# Altium schematic sheet 14-100M_Ethernet.SchDoc
size B; SheetNumber: 14; SheetTotal: 16
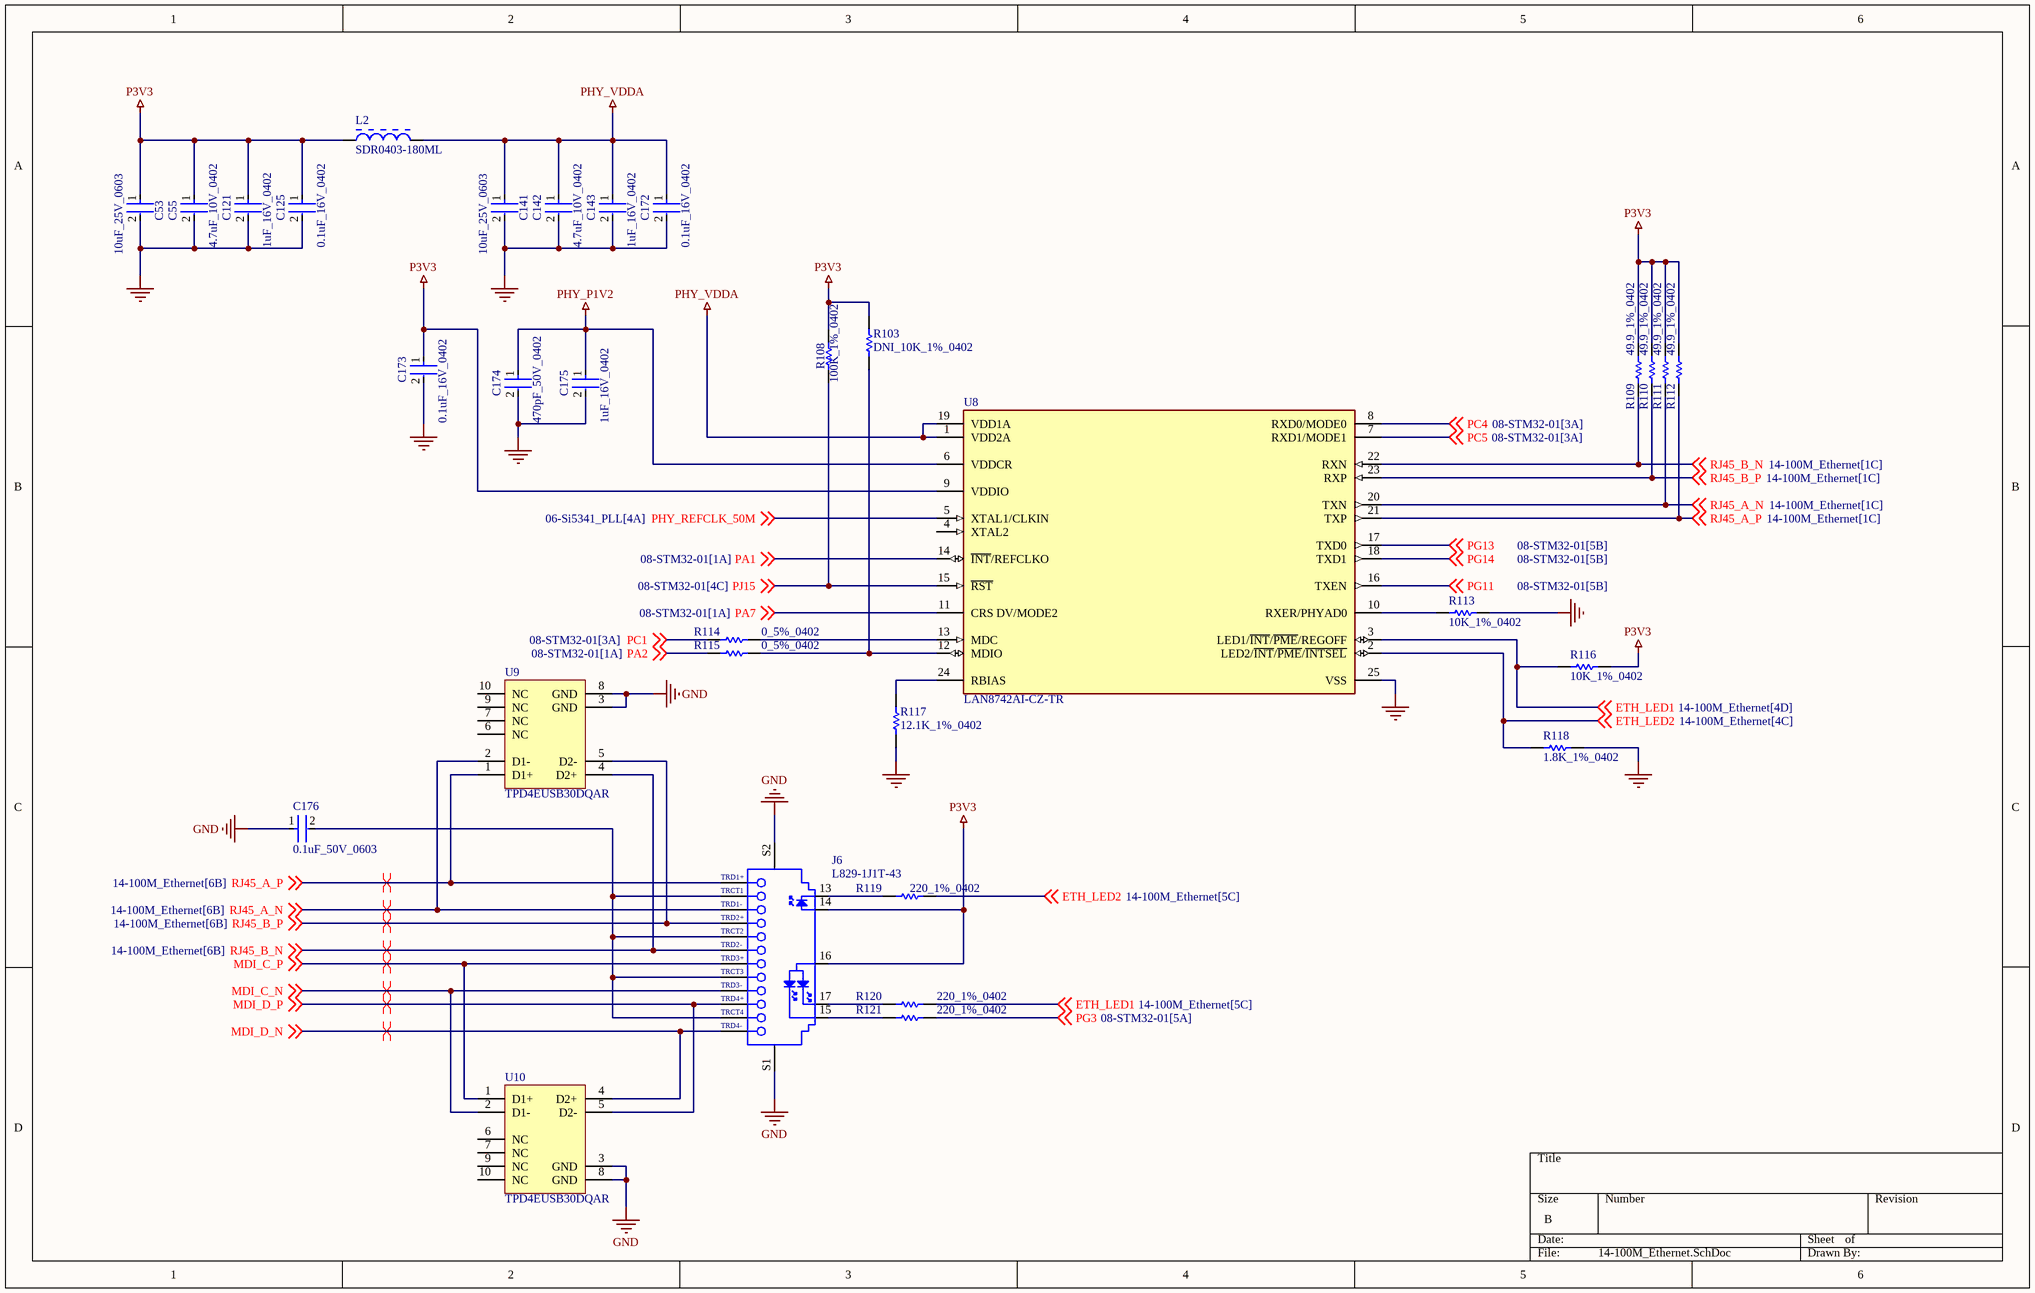
[diagram p0: 14-100M_Ethernet.SchDoc]

## Parts
C53  10uF_25V_0603  [FP-CL10-IPC_C]
C55  4.7uF_10V_0402  [FP-C1005-050-0_15-MFG]
C121  1uF_16V_0402  [FP-0402-L_1_0_0_05-W_0_5-IPC_A]
C125  0.1uF_16V_0402  [FP-C0402-BB-MFG]
C141  10uF_25V_0603  [FP-CL10-IPC_C]
C142  4.7uF_10V_0402  [FP-C1005-050-0_15-MFG]
C143  1uF_16V_0402  [FP-0402-L_1_0_0_05-W_0_5-IPC_A]
C172  0.1uF_16V_0402  [FP-C0402-BB-MFG]
C173  0.1uF_16V_0402  [FP-C0402-BB-MFG]
C174  470pF_50V_0402  [FP-GRM155-0_05-IPC_A]
C175  1uF_16V_0402  [FP-0402-L_1_0_0_05-W_0_5-IPC_A]
C176  0.1uF_50V_0603  [FP-C0603-CJ-MFG]
J6  L829-1J1T-43  [BELS-L829-1J1T-43_V]
L2  SDR0403-180ML  [BOUR-SDR0403-2_V]
R103  DNI_10K_1%_0402  [RESC1005X40X25NL10T10]  (no BOM)
R108  100K_1%_0402  [RESC1005X40X25ML05T10]
R109  49.9_1%_0402  [RESC1005X40X25NL10T10]
R110  49.9_1%_0402  [RESC1005X40X25NL10T10]
R111  49.9_1%_0402  [RESC1005X40X25NL10T10]
R112  49.9_1%_0402  [RESC1005X40X25NL10T10]
R113  10K_1%_0402  [RESC1005X40X25NL10T10]
R114  0_5%_0402  [RESC1005X40X25NL05T10]
R115  0_5%_0402  [RESC1005X40X25NL05T10]
R116  10K_1%_0402  [RESC1005X40X25NL10T10]
R117  12.1K_1%_0402  [RESC1005X40X25ML05T10]
R118  1.8K_1%_0402  [RESC1005X40X25LL05T05]
R119  220_1%_0402  [RESC1005X40X25LL10T10]
R120  220_1%_0402  [RESC1005X40X25LL10T10]
R121  220_1%_0402  [RESC1005X40X25LL10T10]
U8  LAN8742AI-CZ-TR  [FP-C04-143-MFG]
U9  TPD4EUSB30DQAR  [DQA0010A_V]
U10  TPD4EUSB30DQAR  [DQA0010A_V]

## Nets
GND: C53.2 C55.2 C121.2 C125.2 C141.2 C142.2 C143.2 C172.2 C173.2 C174.2 C175.2 C176.1 J6.S1 J6.S2 R113.1 R117.1 R118.2 U8.25(VSS) U9.3(GND) U9.8(GND) U10.3(GND) U10.8(GND)
P3V3: C53.1 C55.1 C121.1 C125.1 C173.1 J6.14 J6.16 L2.1 R103.1 R108.2 R109.1 R110.1 R111.1 R112.1 R116.1 U8.9(VDDIO)
PHY_P1V2: C174.1 C175.1 U8.6(VDDCR)
PHY_VDDA: C141.1 C142.1 C143.1 C172.1 L2.2 U8.1(VDD2A) U8.19(VDD1A)
ETH_LED1: R116.2 R120.2 U8.3(LED1/~{INT}/~{PME}/REGOFF) ; off-sheet ETH_LED1
ETH_LED2: R118.1 R119.2 U8.2(LED2/~{INT}/~{PME}/~{INTSEL}) ; off-sheet ETH_LED2
MDI_C_N: J6.9(TRD3-) U10.2(D1-) ; off-sheet MDI_C_N
MDI_C_P: J6.7(TRD3+) U10.1(D1+) ; off-sheet MDI_C_P
MDI_D_N: J6.12(TRD4-) U10.4(D2+) ; off-sheet MDI_D_N
MDI_D_P: J6.10(TRD4+) U10.5(D2-) ; off-sheet MDI_D_P
PA1: U8.14(~{INT}/REFCLKO) ; off-sheet PA1
PA2: R115.1 ; off-sheet PA2
PA7: U8.11(CRS_DV/MODE2) ; off-sheet PA7
PC1: R114.1 ; off-sheet PC1
PC4: U8.8(RXD0/MODE0) ; off-sheet PC4
PC5: U8.7(RXD1/MODE1) ; off-sheet PC5
PG3: R121.2 ; off-sheet PG3
PG11: U8.16(TXEN) ; off-sheet PG11
PG13: U8.17(TXD0) ; off-sheet PG13
PG14: U8.18(TXD1) ; off-sheet PG14
PHY_REFCLK_50M: U8.5(XTAL1/CLKIN) ; off-sheet PHY_REFCLK_50M
PJ15: R108.1 U8.15(~{RST}) ; off-sheet PJ15
RJ45_A_N: J6.3(TRD1-) R111.2 U8.20(TXN) U9.2(D1-) ; off-sheet RJ45_A_N
RJ45_A_P: J6.1(TRD1+) R112.2 U8.21(TXP) U9.1(D1+) ; off-sheet RJ45_A_P
RJ45_B_N: J6.6(TRD2-) R109.2 U8.22(RXN) U9.4(D2+) ; off-sheet RJ45_B_N
RJ45_B_P: J6.4(TRD2+) R110.2 U8.23(RXP) U9.5(D2-) ; off-sheet RJ45_B_P
NetC176_2: C176.2 J6.2(TRCT1) J6.5(TRCT2) J6.8(TRCT3) J6.11(TRCT4)
NetJ6_13: J6.13 R119.1
NetJ6_15: J6.15 R121.1
NetJ6_17: J6.17 R120.1
NetR103_2: R103.2 R115.2 U8.12(MDIO)
NetR113_2: R113.2 U8.10(RXER/PHYAD0)
NetR114_2: R114.2 U8.13(MDC)
NetR117_2: R117.2 U8.24(RBIAS)

Not connected (* = marked no-connect by the designer): U8 4(XTAL2); U9 6(NC) 7(NC) 9(NC) 10(NC); U10 6(NC) 7(NC) 9(NC) 10(NC)

## Layout directives
differential pair: MDI_C_N, MDI_C_P, MDI_D_N, MDI_D_P, RJ45_A_N, RJ45_A_P, RJ45_B_N, RJ45_B_P

## Library data of the parts
C53 C141 = CMP-13271-004224-1: Cap Ceramic 10uF 25V X5R ±20% Pad SMD 0603 +85°C T/R; Width: 0.031inch; Voltage Rating: 25V; Length: 0.063inch; Case Code (Metric): 1608; Dielectric: X5R; Termination: Wraparound; Capacitance: 10uF; Lead Free: Lead Free; Mount: Surface Mount; Package Quantity: 1; Case Code (Imperial): 0603; Thickness: 0.035inch; Packaging: Tape and Reel; Contact Plating: Tin; Min Operating Temperature: -55°C; Tolerance: 20%; Max Operating Temperature: 85°C; Case/Package: 0603
C55 C142 = CMP-2000-05997-2: CAP CER 4.7UF 10V X5R 0402; Dielectric Material: Ceramic; Tolerance: 10%; Series: C; Package Quantity: 10000; Max Operating Temperature: 85°C; Case Code (Imperial): 0402; Lead Free: Lead Free; Voltage Rating (DC): 10V; Packaging: Cut Tape; Voltage Rating: 10V; Min Operating Temperature: -55°C; Dielectric: X5R; Thickness: 0.022inch; Width: 0.02inch; Case/Package: 0402; Case Code (Metric): 1005; Capacitance: 4.7uF; Length: 0.039inch; RoHS Compliant: Yes; REACH SVHC: No SVHC; Mount: Surface Mount
C121 C143 C175 = CMP-14477-000104-2: None; Tolerance: 10%; Voltage Rating: 16V; Dielectric: X5R; Capacitance: 1uF; Packaging: Tape and Reel; Depth: 0.5mm; Mount: Surface Mount; Thickness: 0.022inch; Package Quantity: 1; Min Operating Temperature: -55°C; Series: M; Voltage Rating (DC): 16V; Termination: SMD/SMT; Case/Package: 0402; Number of Pins: 2; Case Code (Imperial): 0402; Length: 1mm; Halogen Free: Halogen Free; Case Code (Metric): 1005; Width: 0.02inch; RoHS Compliant: Yes; Radiation Hardening: No; Max Operating Temperature: 85°C; Height: 0.5mm; Construction: Flat
C125 C172 C173 = CMP-1034-02068-3: CAP CER 0.1UF 16V 5% X7R 0402; Manufacturer: Kemet; Manufacturer Part Number: C0402C104J4RACTU; Value: 0.10 μF; Temperature Coefficient: 15%; Tolerance: 0.05; Material: Ceramic; ComponentLink2URL: https://content.kemet.com/datasheets/KEM_C1002_X7R_SMD.pdf; Automotive: No; Device Class L2: Capacitors; Temperature: -55°C to +125°C; RoHS: TRUE; Voltage Rating: 16 V; ComponentLink2Description: Datasheet; Device Class L3: Ceramic Capacitors; Temperature Range Low: -55°C; Ipc Land Pattern Name: CAPC10050X50; Device Class L1: Passive Components; Temperature Range High: +125°C; Package: C0402-BB; Capacitance: 0.10 μF; Category: Cap; Mouser Description: CAP CER 0.1UF 16V X7R 0402; Height: 0.55mm; Digikey Description: CAP CER 0.1UF 16V 5% X7R 0402; Octopart: https://octopart.com/c0402c104j4ractu-kemet-12573893; Temperature Characteristic: X7R; Lead Free: Yes
C174 = CMP-2008-04369-2: Chip Multilayer Ceramic Capacitors for General Purpose, 0402, 470pF, C0G, 30ppm/°C, 5%, 50V; Insulation Resistance: 10GR; Depth: 0.5mm; Voltage Rating: 50V; Packaging: Tape and Reel; Material: Ceramic; Lead Free: Lead Free; Max Operating Temperature: 125°C; Length: 1mm; Min Operating Temperature: -55°C; Height: 0.5mm; Width: 0.5mm; Thickness: 0.022inch; Voltage: 50V; Termination: SMD/SMT; Dielectric Material: Ceramic; REACH SVHC: No SVHC; Voltage Rating (DC): 50V; Package Quantity: 1; Dielectric: C0G; Radiation Hardening: No; Mount: Surface Mount; Case/Package: 0402; Number of Pins: 2; Tolerance: 5%; Temperature Coefficient: 30ppm/°C; Case Code (Metric): 1005; Capacitance: 470pF; Case Code (Imperial): 0402
C176 = CMP-2006-03300-2: CAP CER 0.1UF 50V X7R 0603; Manufacturer Part Number: C0603X104K5RACTU; Manufacturer: Kemet; Capacitance: 100nF; Material: Ceramic; Tolerance: 10%; Value: 100nF; Temperature Coefficient: 15%; Temperature Range High: +125°C; Temperature Range Low: -55°C; Voltage: 50V; ComponentLink2Description: Datasheet; RoHS: TRUE; ComponentLink2URL: https://content.kemet.com/datasheets/KEM_C1013_X7R_FT-CAP_SMD.pdf; Device Class L3: Ceramic Capacitors; Device Class L2: Capacitors; Package: C0603-CJ; Height: 0.95mm; Device Class L1: Passive Components; Temperature Characteristic: X7R; Lead Free: Yes; Digikey Description: CAP CER 0.1UF 50V X7R 0603; Automotive: No; Mouser Description: Capacitor; Ceramic; Cap 0.1uF; Tol+10%; SMT; Flexible Termination; Vol-Rtg 50V; TR; Temperature: -55°C to +125°C; Octopart: https://octopart.com/c0603x104k5ractu-kemet-9145062; Category: Cap; Voltage Rating: 50V; Ipc Land Pattern Name: CAPC16080X80
J6 = CMP-1715-00001-1: Gigabit MagJack(R) Ultra Low Profile, 10/100/1000 Base-T, 19-Pin THD, RoHS, Tray; Width: 24.13 mm; RoHSCompliant: True; PartNumber: L829-1J1T-43; Case/Package: Metal; Mount: Through Hole; ComponentLink1Description: Manufacturer URL; Height: 11.3 mm; Package Quantity: 60; Packaging: Tray; Length: 17.78 mm; PackageDescription: 19-Pin Through Hole Device, Body 23.94 x 17.58 mm, Pitch 2.03 mm; ComponentLink2URL: http://belfuse.com/pdfs/L829-1J1T-43.pdf; ComponentLink1URL: http://belfuse.com/ethernet/; Mounting Technology: Through Hole; DatasheetVersion: Rev. G; Pins: 8; ComponentLink2Description: Datasheet
L2 = CMP-0904-00005-1: SDR0403 Series Power Inductor, 18 uF +/- 20 %, 0.34 Ohm, -40 to 125 degC, 2-Pin SMD, RoHS, Tape and Reel; Manufacturer: Bourns; Tolerance (%): +/- 20; I rms (A): 0.84 Max.; Q: 25; I sat (A): 1.3 Typ.; Test Frequency (MHz): 2.52; Inductance (uH): 18; SRF (MHz): 23 Min.; RDC (Ohm): 0.34 Max.; PackageReference: SDR0403-2; ComponentLink1URL: http://www.bourns.com/; RoHS: TRUE; PartNumber: SDR0403-180ML; ComponentLink2Description: Datasheet; Packing: Tape and Reel; Temperature Range: -40 to 125 degC; Mounting Technology: Surface Mount; DatasheetVersion: Feb-12; PackageDescription: 3-Pin SMD, Dia 4.5 mm, Height 3.5 mm; ComponentLink2URL: http://www.bourns.com/data/global/pdfs/sdr0403.pdf; ComponentLink1Description: Manufacturer URL
R103 R113 R116 = CMP-2002-04694-1: Manufacturer: Bourns; Part Number: CR0402-FX-1002GLF
R108 = CMP-2002-07852-1: Manufacturer: Yageo; Part Number: RC0402FR-13100KL
R109-R112 = CMP-2002-04448-1: Part Number: RK73H1ETTP49R9F; Manufacturer: KOA Speer
R114 R115 = CMP-2002-06457-1: Manufacturer: Panasonic; Part Number: ERJ-U020R00X
R117 = CMP-2002-07375-1: Part Number: RC0402FR-0712K1L; Manufacturer: Yageo / Phycomp
R118 = CMP-2002-01128-1: Manufacturer: Panasonic; Part Number: ERJ2RKF1801X
R119-R121 = CMP-2002-03891-1: Part Number: RK73H1ETTP2200F; Manufacturer: KOA Speer
U8 = CMP-06281-000002-1: IC TRANSCEIVER FULL 1/1 24SQFN; Manufacturer: Microchip; Simplex Duplex: Full Duplex; Max Supply Voltage: 3.6V; Standoff Height: 0mm; Number Of Channels: 1; Data Rate: 100Mbits/s; Interface: Ethernet,Other; Min Supply Voltage: 1.14V; Ambient Temperature Range Low: -40°C; Height: 1mm; Digikey Description: IC TRANSCEIVER FULL 1/1 24SQFN; Lead Free: Yes; Category: IC; Temperature Range Low: -40°C; Temperature: -40°C to +85°C; RoHS: TRUE; ComponentLink2URL: http://ww1.microchip.com/downloads/en/DeviceDoc/DS_LAN8742_00001989A.pdf; Package: C04-143; Mouser Description: Small Footprint RMII 10/100 Ethernet Transceiver with flexPWR Technology; Device Class L1: Integrated Circuits (ICs); Temperature Range High: +85°C; Device Class L2: Interface ICs; ComponentLink2Description: Datasheet; Manufacturer Part Number: LAN8742AI-CZ-TR; Device Class L3: Ethernet Interface ICs; Ambient Temperature Range High: +85°C; Ipc Land Pattern Name: QFN50P400X400X90-24; Octopart: https://octopart.com/lan8742ai-cz-tr-microchip-29030589; Automotive: No
U9 U10 = CMP-0326-00027-3: ESD Solution for Super-Speed (6 GBPS) USB 3.0 Interface, 4 Channels, -40 to +85 degC, 10-pin SON (DQA), Green (RoHS & no Sb/Br); Manufacturer: Texas Instruments; Differential Capacitance(pF): 0.05; Serial ATA / eSATA: TRUE; IO Capacitance(Typ)(pF): 0.8; IO Leakage Current(nA): 10; IEC 61000-4-2 Air-Gap(+/- kV): 8; ComponentLink3Description: URL Link1; PartNumber: TPD4EUSB30DQAR; DatasheetVersion: SLVSAC2C; ComponentLink2URL: http://www.ti.com/general/docs/lit/getliterature.tsp?genericPartNumber=TPD4EUSB30&fileType=pdf; USB Super Speed: TRUE; Eco-Plan: Green (RoHS & no Sb/Br); Mounting Technology: Surface Mount; 1394 / Firewire: TRUE; PackageVersion: revB, Sep-2009; SubFamily: ESD Solution; USB Full Speed: TRUE; USB High Speed: TRUE; ComponentLink2Description: Datasheet; ComponentLink1URL: http://www.ti.com/; IEC 61000-4-2 Contact(+/- kV): 8; Breakdown Voltage(Min)(V): 8; PackageReference: DQA0010A; ComponentLink1Description: Manufacturer URL; PackageDescription: 10-Pin Plastic Small Outline No-Lead, 1 x 2.5 x 0.55 mm Body, 0.5 mm Pitch; ComponentLink3URL: SamplesURL:http://www.ti.com/product/tpd4eusb30#samples; HDMI: TRUE